# EAGLE design lcd (EAGLE 6.5.0)
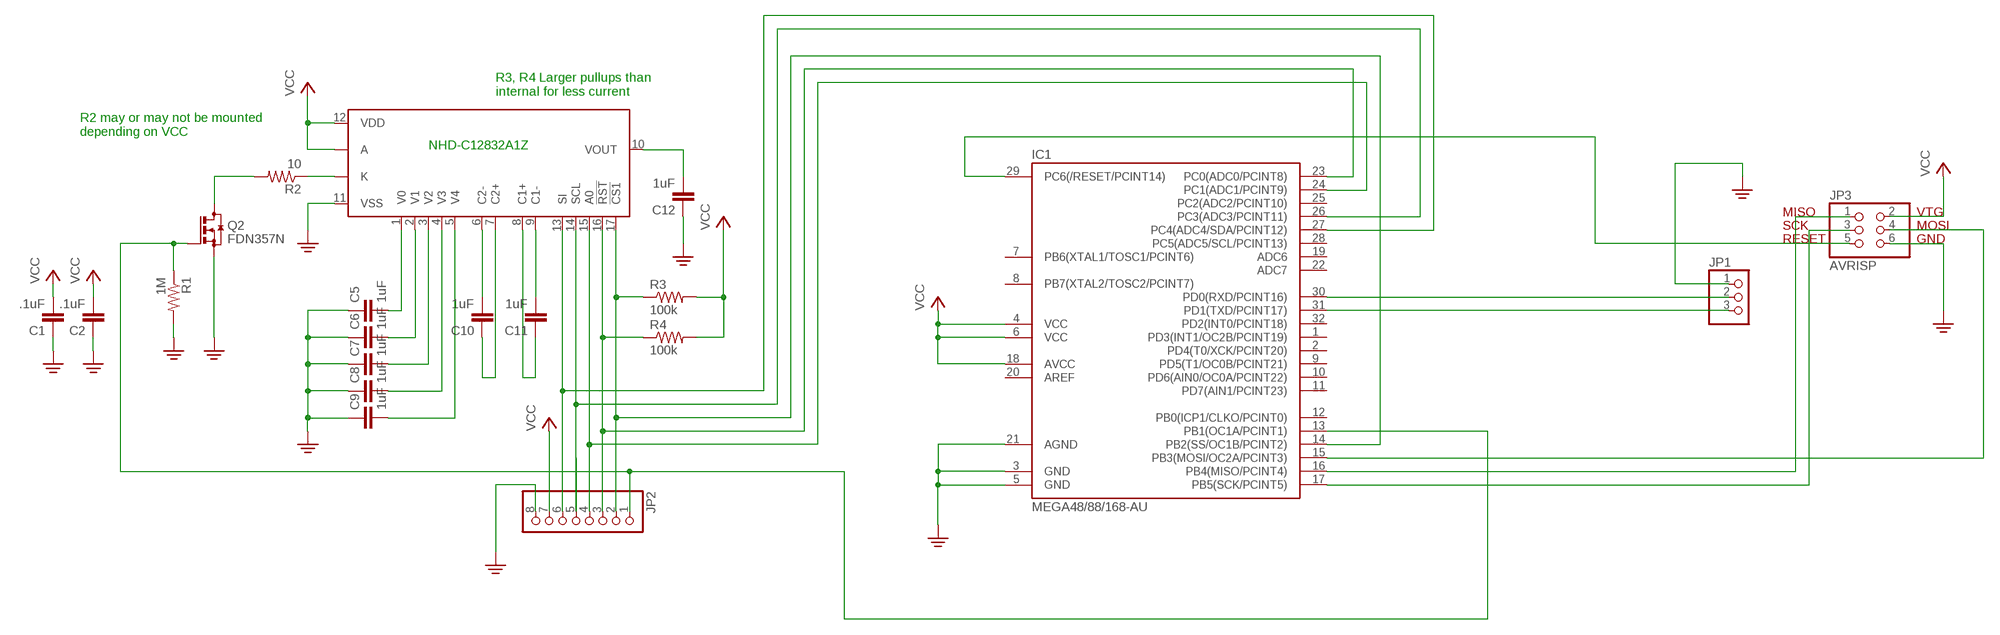
[diagram p0: schematic, sheet 1]

## Parts
C1  .1uF  C-EUC0603  [C0603]
C2  .1uF  C-EUC0603  [C0603]
C5  1uF  C-EUC0603  [C0603]
C6  1uF  C-EUC0603  [C0603]
C7  1uF  C-EUC0603  [C0603]
C8  1uF  C-EUC0603  [C0603]
C9  1uF  C-EUC0603  [C0603]
C10  1uF  C-EUC0603  [C0603]
C11  1uF  C-EUC0603  [C0603]
C12  1uF  C-EUC0603  [C0603]
IC1  MEGA48/88/168-AU  [TQFP32-08]
JP1  PINHD-1X3  [1X03]
JP2  PINHD-1X8  [1X08]
JP3  AVRISP  [2X03]
Q2  FDN357N  BSS123  [SOT23]
R1  1M  R-US_R0603  [R0603]
R2  10  R-US_R0603  [R0603]
R3  100k  R-US_R0603  [R0603]
R4  100k  R-US_R0603  [R0603]
U$1  NHD-C12832A1Z  [NHD-C12832A1Z]

## Nets
GND: C1.1 C2.1 C5.1 C6.1 C7.1 C8.1 C9.1 C12.1 IC1.3(GND) IC1.5(GND) IC1.21(AGND) JP1.1 JP2.8 JP3.6 Q2.2(S) R1.2 U$1.11(VSS)
N$1: IC1.29(PC6(/RESET/PCINT14)) JP3.5
N$3: IC1.14(PB2(SS/OC1B/PCINT2)) JP2.2 R3.1 U$1.17(!CS1)
N$4: IC1.23(PC0(ADC0/PCINT8)) JP2.3 R4.1 U$1.16(!RST)
N$5: IC1.26(PC3(ADC3/PCINT11)) JP2.5 U$1.14(SCL)
N$6: R2.1 U$1.K
N$8: IC1.24(PC1(ADC1/PCINT9)) JP2.4 U$1.15(A0)
N$9: C12.2 U$1.10(VOUT)
N$10: IC1.17(PB5(SCK/PCINT5)) JP3.3
N$11: IC1.16(PB4(MISO/PCINT4)) JP3.1
N$12: IC1.15(PB3(MOSI/OC2A/PCINT3)) JP3.4
N$13: IC1.30(PD0(RXD/PCINT16)) JP1.2
N$14: IC1.31(PD1(TXD/PCINT17)) JP1.3
N$15: IC1.27(PC4(ADC4/SDA/PCINT12)) JP2.6 U$1.13(SI)
N$18: IC1.13(PB1(OC1A/PCINT1)) JP2.1 Q2.1(G) R1.1
N$21: C5.2 U$1.1(V0)
N$22: Q2.3(D) R2.2
N$30: C6.2 U$1.2(V1)
N$31: C9.2 U$1.5(V4)
N$32: C7.2 U$1.3(V2)
N$33: C8.2 U$1.4(V3)
N$38: C11.1 U$1.8(C1+)
N$39: C10.2 U$1.6(C2-)
N$40: C10.1 U$1.7(C2+)
N$41: C11.2 U$1.9(C1-)
VCC: C1.2 C2.2 IC1.4(VCC) IC1.6(VCC) IC1.18(AVCC) JP2.7 JP3.2 R3.2 R4.2 U$1.12(VDD) U$1.A
Unconnected: IC1.1(PD3(INT1/OC2B/PCINT19)) IC1.2(PD4(T0/XCK/PCINT20)) IC1.7(PB6(XTAL1/TOSC1/PCINT6)) IC1.8(PB7(XTAL2/TOSC2/PCINT7)) IC1.9(PD5(T1/OC0B/PCINT21)) IC1.10(PD6(AIN0/OC0A/PCINT22)) IC1.11(PD7(AIN1/PCINT23)) IC1.12(PB0(ICP1/CLKO/PCINT0)) IC1.19(ADC6) IC1.20(AREF) IC1.22(ADC7) IC1.25(PC2(ADC2/PCINT10)) IC1.28(PC5(ADC5/SCL/PCINT13)) IC1.32(PD2(INT0/PCINT18))

## Notes on the sheet
- R3, R4 Larger pullups than 
  internal for less current
- R2 may or may not be mounted 
  depending on VCC
- NHD-C12832A1Z

## Library data of the parts
C1 C2 C5-C12 = resistor:C-EU: CAPACITOR, European symbol
IC1 = avr-6:MEGA48/88/168
JP1 = pinhead:PINHD-1X3: PIN HEADER
JP2 = pinhead:PINHD-1X8: PIN HEADER
JP3 = atmel-isp-headers:AVRISP: AVR ISP Connector Programming header for connecting to ISP's like the Dragon
Q2 = transistor-small-signal:BSS123: N-CHANNEL MOS FET
R1-R4 = rcl:R-US_: RESISTOR, American symbol
U$1 = custom-lcd:NHD-C12832A1Z

## Board
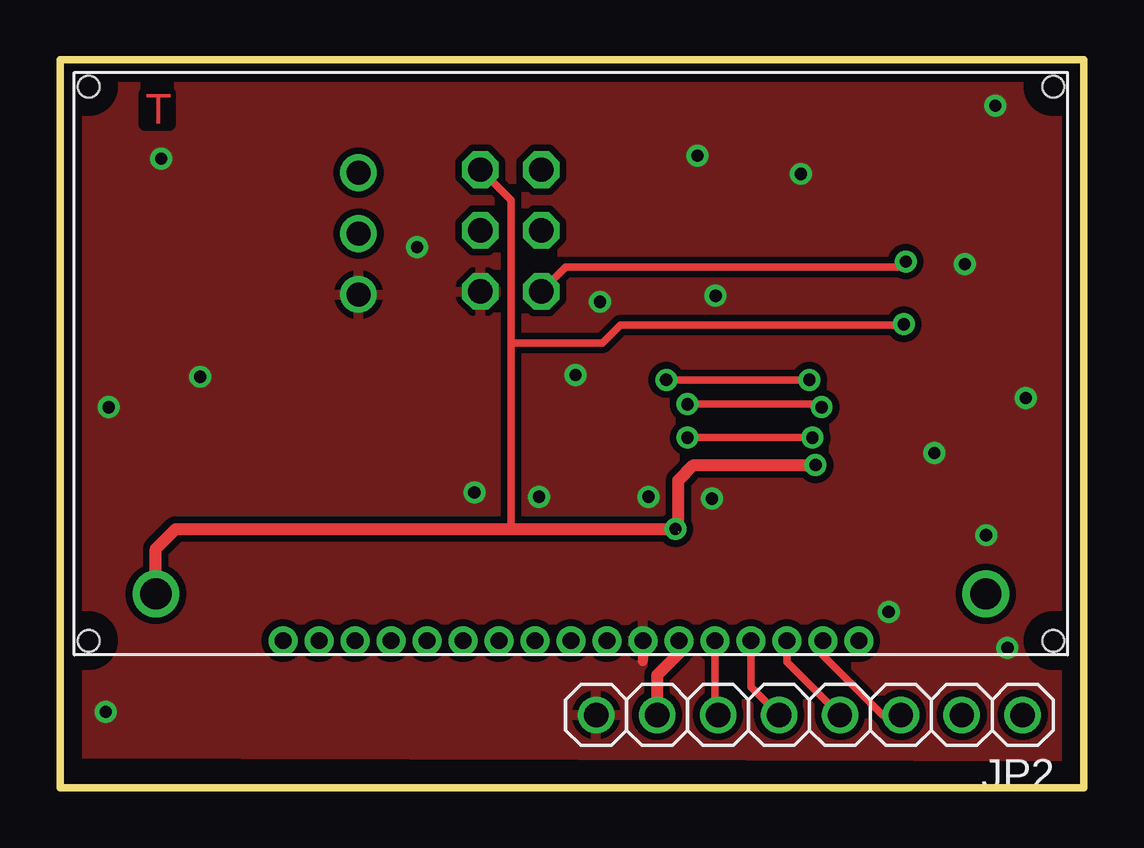
[diagram p1: board, top side]
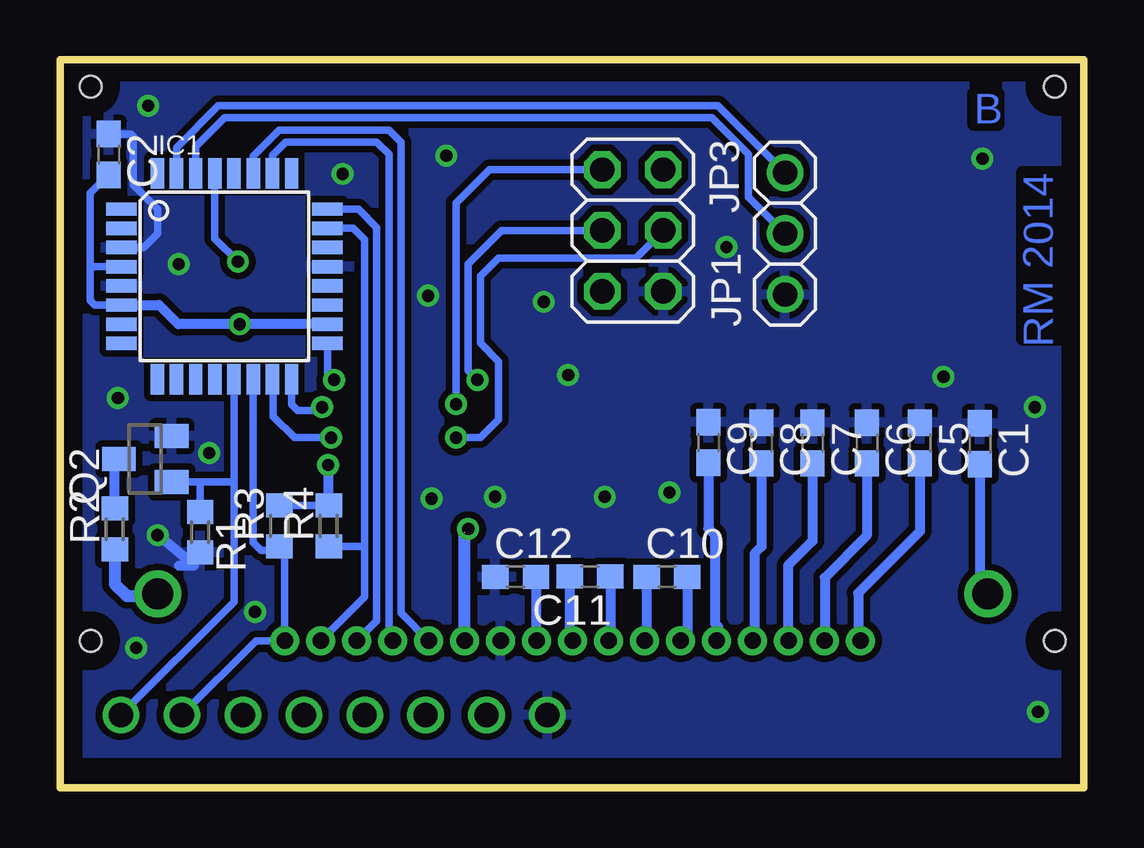
[diagram p2: board, bottom side, seen from below]

Size 42.67 x 30.35 mm. Coordinates in mm from the lower left corner, seen from the top.
Outline: 0,0 0,30.35 42.67,30.35 42.67,0 0,0
Copper layers (1*16): Top 0.035mm / dielectric 1.5mm / Bottom 0.035mm
Design rules "default": minimum track width 10mil, minimum drill 20mil, track to track 7mil, track to pad 7mil, pad to pad 7mil, via to via 7mil, smd to smd 7mil, copper to edge 30mil, drill to drill 7mil, minimum pad ring 10mil, minimum via ring 8mil, stop-mask expansion 4mil, vias tented up to drill 0mil, thermal gap 10mil

### Footprints (pad centres in the part's own frame; a part is rotated, then mirrored left to right if it is on the bottom)
C0603 = smd 1.1 x 1: 1 -0.85,0; 2 0.85,0
TQFP32-08 = smd 1.27 x 0.559: 1 -4.293,2.8; 2 -4.293,2; 3 -4.293,1.2; 4 -4.293,0.4; 5 -4.293,-0.4; 6 -4.293,-1.2; 7 -4.293,-2; 8 -4.293,-2.8; 17 4.293,-2.8; 18 4.293,-2; 19 4.293,-1.2; 20 4.293,-0.4; 21 4.293,0.4; 22 4.293,1.2; 23 4.293,2; 24 4.293,2.8 | smd 0.559 x 1.27: 9 -2.8,-4.293; 10 -2,-4.293; 11 -1.2,-4.293; 12 -0.4,-4.293; 13 0.4,-4.293; 14 1.2,-4.293; 15 2,-4.293; 16 2.8,-4.293; 25 2.8,4.293; 26 2,4.293; 27 1.2,4.293; 28 0.4,4.293; 29 -0.4,4.293; 30 -1.2,4.293; 31 -2,4.293; 32 -2.8,4.293
1X03 = drill 1.016: 1 -2.54,0; 2 0,0; 3 2.54,0
1X08 = drill 1.016: 1 -8.89,0; 2 -6.35,0; 3 -3.81,0; 4 -1.27,0; 5 1.27,0; 6 3.81,0; 7 6.35,0; 8 8.89,0
2X03 = drill 1.016 octagon: 1 -2.54,-1.27; 2 -2.54,1.27; 3 0,-1.27; 4 0,1.27; 5 2.54,-1.27; 6 2.54,1.27
SOT23 = smd 1 x 1.4: 1 -0.95,-1.1; 2 0.95,-1.1; 3 0,1.1
R0603 = smd 1 x 1.1: 1 -0.85,0; 2 0.85,0
NHD-C12832A1Z = drill 0.7: 1 8.7,0; 2 10.2,0; 3 11.7,0; 4 13.2,0; 5 14.7,0; 6 16.2,0; 7 17.7,0; 8 19.2,0; 9 20.7,0; 10 22.2,0; 11 23.7,0; 12 25.2,0; 13 26.7,0; 14 28.2,0; 15 29.7,0; 16 31.2,0; 17 32.7,0 | drill 1.3: A 3.4,1.95; K 38,1.95 | hole 0.9: 0.6,0; 0.6,23.1; 40.8,0; 40.8,23.1

### Placement (x,y rotation side)
C1  4.32,14.35 270 bottom
C2  40.64,26.42 270 bottom
C5  6.83,14.38 270 bottom
C6  9.04,14.38 270 bottom
C7  11.3,14.38 270 bottom
C8  13.43,14.38 270 bottom
C9  15.64,14.41 270 bottom
C10  17.37,8.81 0 bottom
C11  20.58,8.82 180 bottom
C12  23.68,8.81 0 bottom
IC1  35.81,21.34 0 bottom
JP1  12.45,23.11 90 bottom
JP2  31.24,3.05 180 top
JP3  18.8,23.24 270 bottom
Q2  39.12,13.72 90 bottom
R1  36.83,10.67 270 bottom
R2  40.39,10.8 90 bottom
R3  33.53,10.92 90 bottom
R4  31.47,10.92 90 bottom
U$1  0.6,6.14 0 top

### Tracks (layer width: path | path; a pad name or v marks a point on that pad's centre or on a via)
GND  (via drill 0.51)
  Top 0.406: U$1.11 24.3,5.29
  Bottom 0.305: IC1.3 39.19,22.54 38.61,23.11 38.61,24.13 39.62,25.15 39.62,27.18 39.71,27.27 C2.1
  Bottom 0.406: 37.72,9.27 37.08,9.27 v38.61,10.54
  other vias: 4.22,26.24 24.54,12.14 1.9,3.17 2.03,15.88 17.27,12.32 27.18,12.07 40.26,16.26 34.54,7.34 39.5,5.84 5.84,17.14 38.99,28.45 37.72,21.84 21.49,17.22 26.57,26.37 14.88,22.56 30.89,25.6 22.5,20.27 19.96,12.14 27.33,20.52 36.45,13.97
  pour Bottom (isolate 0.279): 0.69,30.02 0.56,1.44 42.6,1.44 42.73,30.02
  pour Top (isolate 0.279): 0.69,30.02 0.56,1.44 42.6,1.32 42.73,29.89
N$1  (via drill 0.51)
  Top 0.305: 20.09,20.73 JP3.5 21.08,21.72 35.26,21.72
  Top 0.406: v35.26,21.95 35.26,21.72
  Bottom 0.305: IC1.29 36.21,22.9 v35.26,21.95
N$3
  Bottom 0.305: IC1.14 34.61,10.23 34.29,9.91 33.69,9.91 | R3.1 33.3,9.84 U$1.17 34.5,6.14 JP2.2
  Bottom 0.406: 33.69,9.91 R3.1
N$4
  Top 0.254: 31.75,6.19 U$1.16
  Top 0.305: U$1.16 31.8,5.54 34.29,3.05 JP2.3
  Bottom 0.305: IC1.23 30.45,23.34 29.97,22.86 29.97,10.16 | 29.97,10.16 29.97,7.97 U$1.16 | R4.1 30.06,10.07 29.97,10.16
  Bottom 0.406: 35.18,2.92 JP2.3
N$5
  Top 0.305: U$1.14 28.8,4.22 JP2.5
  Bottom 0.305: IC1.26 33.81,26.38 33.27,26.92 29.46,26.92 28.96,26.42 28.96,6.3 U$1.14
N$6
  Bottom 0.508: R2.1 40.39,8.51 39.88,8 38.69,8 U$1.K
N$8
  Top 0.305: U$1.15 30.3,5.26 JP2.4
  Bottom 0.305: IC1.24 30.23,24.14 29.46,23.37 29.46,6.98 U$1.15
N$9
  Bottom 0.406: C12.2 22.83,6.17 U$1.10
N$10  (via drill 0.51)
  Top 0.305: v25.27,17.02 v31.24,17.02
  Bottom 0.305: JP3.3 24.26,23.24 25.65,21.84 25.65,17.4 v25.27,17.02 | IC1.17 31.52,17.3 v31.24,17.02
N$11  (via drill 0.51)
  Top 0.305: v26.16,16 31.62,16 v31.75,15.88
  Bottom 0.305: JP3.1 24.76,25.78 26.16,24.38 v26.16,16 | IC1.16 33.01,16 32.77,15.75 31.88,15.75
  Bottom 0.406: 31.88,15.75 v31.75,15.88
N$12  (via drill 0.51)
  Top 0.305: v26.16,14.61 v31.37,14.61
  Bottom 0.305: JP3.4 18.67,22.1 24.38,22.1 25.15,21.34 25.15,18.54 24.38,17.78 24.38,15.37 25.15,14.61 v26.16,14.61 | v31.37,14.61 32.89,14.61 33.78,15.49 33.78,17.01 IC1.15
N$13
  Bottom 0.305: IC1.30 37.01,26.74 35.81,27.94 15.49,27.94 13.97,26.42 13.97,24.64 JP1.2
N$14
  Bottom 0.305: IC1.31 37.81,26.7 36.07,28.45 15.24,28.45 JP1.3
N$15
  Top 0.305: U$1.13 27.3,3.18 JP2.6
  Bottom 0.305: U$1.13 28.45,7.29 28.45,26.92 28.96,27.43 33.53,27.43 34.61,26.35 IC1.27
N$18
  Bottom 0.305: IC1.13 35.41,12.7 | 35.41,12.7 35.41,7.77 JP2.1 | Q2.1 36.83,12.77 | 36.83,12.77 35.48,12.77 35.41,12.7 | R1.1 36.83,12.77
N$21
  Bottom 0.406: C5.2 6.83,10.7 9.4,8.13 9.4,6.24 U$1.1
N$22
  Bottom 0.406: Q2.3 40.39,13.55 R2.2
N$30
  Bottom 0.406: C6.2 9.04,10.52 10.79,8.76 U$1.2
N$31
  Bottom 0.406: C9.2 15.64,10.82 15.37,10.54 15.37,6.86 15.24,6.73 15.24,6.2 U$1.5
N$32
  Bottom 0.406: C7.2 11.3,10.29 12.32,9.27 12.32,6.16 U$1.3
N$33
  Bottom 0.406: C8.2 13.43,10.06 13.72,9.78 13.72,6.23 U$1.4
N$38
  Bottom 0.406: C11.1 19.73,6.21 U$1.8
N$39
  Bottom 0.406: C10.2 16.52,6.42 U$1.6
N$40
  Bottom 0.406: C10.1 18.22,6.22 U$1.7
N$41
  Bottom 0.406: C11.2 21.43,6.27
  Bottom 0.508: 21.43,6.27 U$1.9
VCC  (via drill 0.51)  (1 unrouted)
  Top 0.305: 18.8,10.8 18.8,18.54 | 18.8,18.54 18.8,24.51 JP3.2 | 18.8,18.54 22.61,18.54 23.37,19.3 35.15,19.3
  Top 0.406: 35.15,19.3 v35.18,19.34
  Top 0.508: U$1.A 4,9.97 4.83,10.8 18.8,10.8 v25.65,10.8 | 25.78,10.67 25.78,12.83 26.42,13.46 v31.5,13.46 | U$1.12 25.8,5.61 24.89,4.7 JP2.7
  Top 0.813: 25.78,6.16 U$1.12
  Bottom 0.305: R4.2 R3.2 | IC1.4 41.29,21.74 41.4,21.84 | 41.4,21.84 41.4,24.8 C2.2 | IC1.6 41.22,20.14 41.4,20.32 41.4,21.84
  Bottom 0.406: C1.2 4.32,8.41 U$1.A | IC1.6 38.54,20.14 37.74,19.34 v35.18,19.34 IC1.18 | R4.2 31.47,13.44 v31.5,13.46
  Bottom 0.508: U$1.12 25.8,10.65 v25.65,10.8

### Text on the board
Top: T
Bottom: B | RM 2014